# Altium project Main-2026.PrjPcb
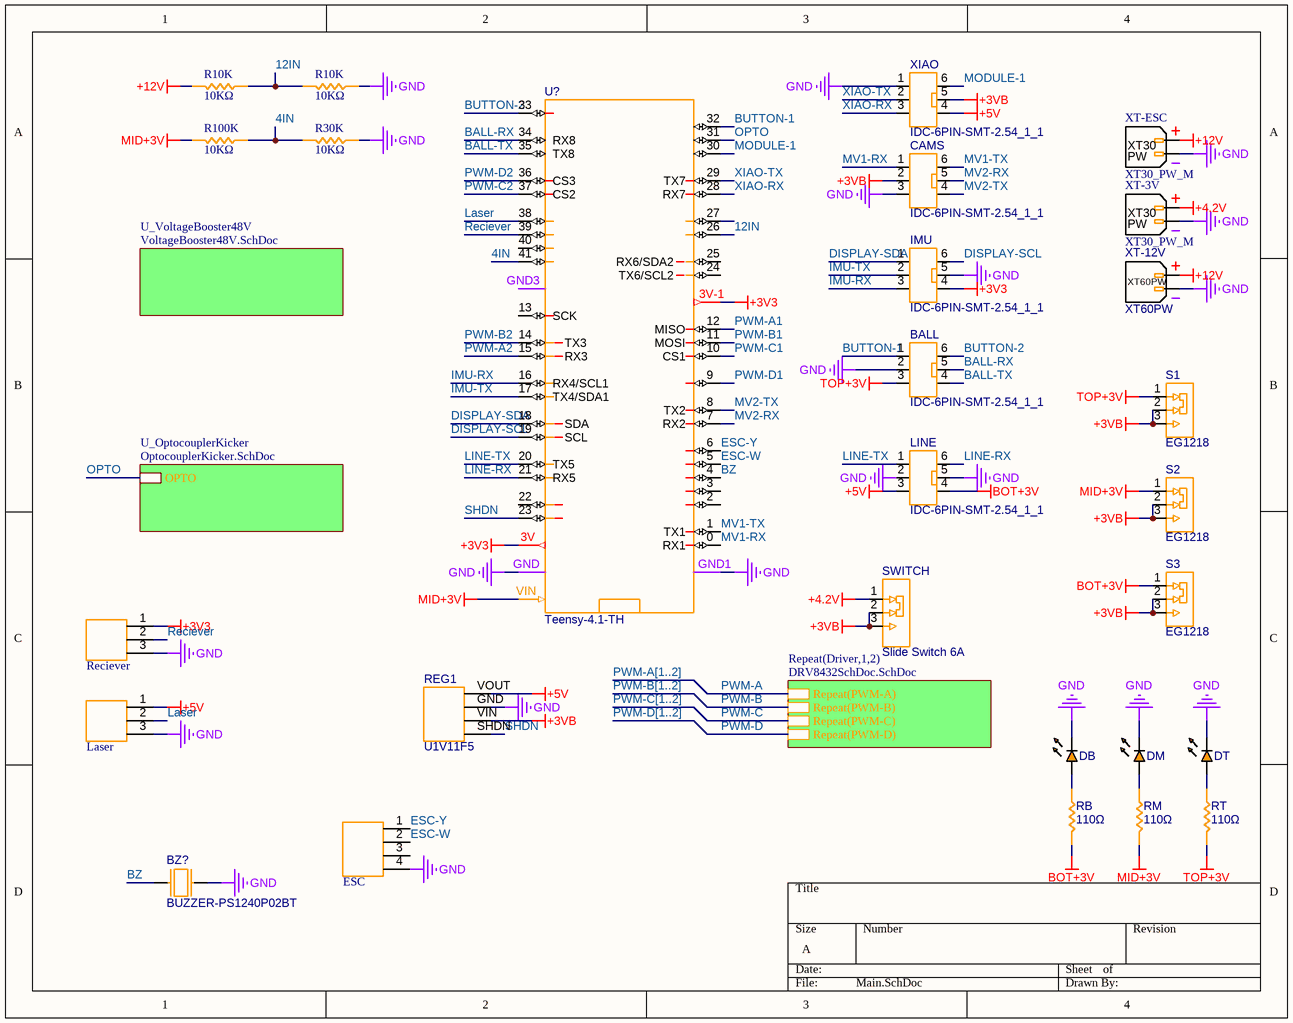
[diagram p0: Main.SchDoc]
4 sheets, 86 parts. Net scope: hierarchical (ports join the sheet entries above them; power ports are global).
Board file: MainBoard-16.PcbDoc
Sheets:
  Main.SchDoc
    Driver1 = DRV8432SchDoc.SchDoc
    Driver2 = DRV8432SchDoc.SchDoc
    U_VoltageBooster48V = VoltageBooster48V.SchDoc
    U_OptocouplerKicker = OptocouplerKicker.SchDoc

## Sheet Main.SchDoc
size A; SheetNumber: 1; SheetTotal: 4

### Parts
(Parts that share a designator on the sheet are numbered #1, #2 ... from top to bottom, then left to right.)
BALL  IDC-6PIN-SMT-2.54_1_1  [IDC-6PIN-SMT-2.54]
BZ?  BUZZER-PS1240P02BT  [BUZZER-PS1240P02BT]
CAMS  IDC-6PIN-SMT-2.54_1_1  [IDC-6PIN-SMT-2.54]
DB  LED_0603  [LED_0603]  (value not drawn)
DM  LED_0603  [LED_0603]  (value not drawn)
DT  LED_0603  [LED_0603]  (value not drawn)
ESC  4PIN  [4PIN]  (value not drawn)
IMU  IDC-6PIN-SMT-2.54_1_1  [IDC-6PIN-SMT-2.54]
Laser  3PIN  [3PIN]  (value not drawn)
LINE  IDC-6PIN-SMT-2.54_1_1  [IDC-6PIN-SMT-2.54]
R10K#1  10KΩ  [RES_0603]
R10K#2  10KΩ  [RES_0603]
R30K  10KΩ  [RES_0603]
R100K  10KΩ  [RES_0603]
RB  110Ω  [RES_0603]
Reciever  3PIN  [3PIN]  (value not drawn)
REG1  U1V11F5  [U1V11F5]
RM  110Ω  [RES_0603]
RT  110Ω  [RES_0603]
S1  EG1218  [EG1218]
S2  EG1218  [EG1218]
S3  EG1218  [EG1218]
SWITCH  Slide Switch 6A  [Slide Switch 6A]
U?  Teensy-4.1-TH  [Teensy-4.1-TH]
XIAO  IDC-6PIN-SMT-2.54_1_1  [IDC-6PIN-SMT-2.54]
XT-3V  XT30_PW_M  [XT30_PW_M]
XT-12V  XT60PW  [XT60PW]
XT-ESC  XT30_PW_M  [XT30_PW_M]

### Sub-sheets
Repeat(Driver,1,2) = DRV8432SchDoc.SchDoc: Repeat(PWM-A), Repeat(PWM-B), Repeat(PWM-C), Repeat(PWM-D)
U_OptocouplerKicker = OptocouplerKicker.SchDoc: OPTO
U_VoltageBooster48V = VoltageBooster48V.SchDoc: no entries

### Nets
+3V3: IMU.4 Reciever.1 U?.3V U?.3V-1
+3VB: CAMS.2 REG1.VIN S1.2(COM) S1.3(NO) S2.2(COM) S2.3(NO) S3.2(COM) S3.3(NO) SWITCH.2(COM) SWITCH.3(NO) XIAO.5
+4.2V: SWITCH.1(NC) XT-3V.P
+5V: Laser.1 LINE.3 REG1.VOUT XIAO.4
+12V: R10K#1.1 XT-12V.P XT-ESC.P
BOT+3V: LINE.4 RB.1 S3.1(NC)
GND: BALL.2 BZ?.2 CAMS.3 DB.C DM.C DT.C ESC.4 IMU.5 Laser.3 LINE.2 LINE.5 R10K#2.2 R30K.2 Reciever.3 REG1.GND U?.GND U?.GND1 XIAO.1 XT-3V.N XT-12V.N XT-ESC.N
MID+3V: R100K.1 RM.1 S2.1(NC) U?.VIN
TOP+3V: BALL.3 RT.1 S1.1(NC)
4IN: R30K.1 R100K.2 U?.41
12IN: R10K#1.2 R10K#2.1 U?.26
BALL-RX: BALL.5 U?.34(RX8)
BALL-TX: BALL.4 U?.35(TX8)
BUTTON-1: BALL.1 U?.32
BUTTON-2: BALL.6 U?.33
BZ: BZ?.1 U?.4
DISPLAY-SCL: IMU.6 U?.19(SCL)
DISPLAY-SDA: IMU.1 U?.18(SDA)
ESC-W: ESC.2 U?.5
ESC-Y: ESC.1 U?.6
IMU-RX: IMU.3 U?.16(RX4/SCL1)
IMU-TX: IMU.2 U?.17(TX4/SDA1)
Laser: Laser.2 U?.38
LINE-RX: LINE.6 U?.21(RX5)
LINE-TX: LINE.1 U?.20(TX5)
MODULE-1: U?.30 XIAO.6
MV1-RX: CAMS.1 U?.0(RX1)
MV1-TX: CAMS.6 U?.1(TX1)
MV2-RX: CAMS.5 U?.7(RX2)
MV2-TX: CAMS.4 U?.8(TX2)
OPTO: U?.31 ; sheet U_OptocouplerKicker/OPTO
PWM-A: sheet Repeat(Driver,1,2)/Repeat(PWM-A)
PWM-A1: U?.12(MISO)
PWM-A2: U?.15(RX3)
PWM-B: sheet Repeat(Driver,1,2)/Repeat(PWM-B)
PWM-B1: U?.11(MOSI)
PWM-B2: U?.14(TX3)
PWM-C: sheet Repeat(Driver,1,2)/Repeat(PWM-C)
PWM-C1: U?.10(CS1)
PWM-C2: U?.37(CS2)
PWM-D: sheet Repeat(Driver,1,2)/Repeat(PWM-D)
PWM-D1: U?.9
PWM-D2: U?.36(CS3)
Reciever: Reciever.2 U?.39
SHDN: REG1.SHDN U?.23
XIAO-RX: U?.28(RX7) XIAO.3
XIAO-TX: U?.29(TX7) XIAO.2
NetDB_A: DB.A RB.2
NetDM_A: DM.A RM.2
NetDT_A: DT.A RT.2

Not connected (* = marked no-connect by the designer): ESC 3(03); U? 2 3 13(SCK) 22 24(TX6/SCL2) 25(RX6/SDA2) 27 40 GND3

### Buses and harness runs
bus PWM-A[1..2]
bus PWM-B[1..2]
bus PWM-C[1..2]
bus PWM-D[1..2]

### Notes on the sheet
- (in symbol XT30_PW_M) XT30; PW

### Library data of the parts
ESC = 4PIN: 2.54 Header
Laser Reciever = 3PIN: 2.54 Header
R10K#1 R10K#2 R30K R100K RB RM RT = RES_0603: Resistor SMD 0603 generic

## Sheet DRV8432SchDoc.SchDoc
size A; SheetNumber: 2; SheetTotal: 4
Used 2 times, as channels Driver1, Driver2. Parts and nets are listed once, with the designators drawn on the sheet.
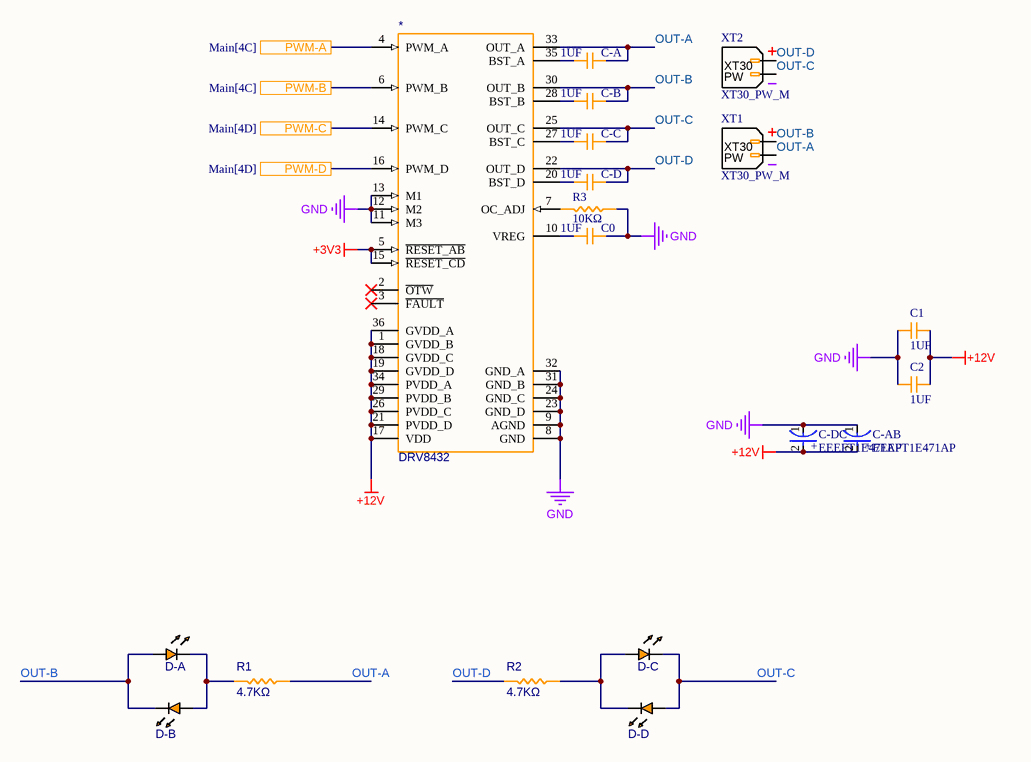
[diagram p1: DRV8432SchDoc.SchDoc]

### Parts
*  DRV8432  [DRV8432]
C0  1UF  [CAP_0603]
C1  1UF  [CAP_0603]
C2  1UF  [CAP_0603]
C-A  1UF  [CAP_0603]
C-AB  EEEFT1E471AP  [FP-FTF-MFG]
C-B  1UF  [CAP_0603]
C-C  1UF  [CAP_0603]
C-D  1UF  [CAP_0603]
C-DC  EEEFT1E471AP  [FP-FTF-MFG]
D-A  LED_0603  [LED_0603]  (value not drawn)
D-B  LED_0603  [LED_0603]  (value not drawn)
D-C  LED_0603  [LED_0603]  (value not drawn)
D-D  LED_0603  [LED_0603]  (value not drawn)
R1  4.7KΩ  [RES_0603]
R2  4.7KΩ  [RES_0603]
R3  10KΩ  [RES_0603]
XT1  XT30_PW_M  [XT30_PW_M]
XT2  XT30_PW_M  [XT30_PW_M]

### Ports
PWM-A (see Main[4C]), PWM-B (see Main[4C]), PWM-C (see Main[4D]), PWM-D (see Main[4D])

### Nets
+3V3: *.5(~{RESET_AB}) *.15(~{RESET_CD})
+12V: *.1(GVDD_B) *.17(VDD) *.18(GVDD_C) *.19(GVDD_D) *.21(PVDD_D) *.26(PVDD_C) *.29(PVDD_B) *.34(PVDD_A) *.36(GVDD_A) C1.2 C2.2 C-AB.2(A) C-DC.2(A)
GND: *.8(GND) *.9(AGND) *.11(M3) *.12(M2) *.13(M1) *.23(GND_D) *.24(GND_C) *.31(GND_B) *.32(GND_A) C0.2 C1.1 C2.1 C-AB.1(C) C-DC.1(C) R3.2
OUT-A: *.33(OUT_A) C-A.2 R1.2 XT1.N
OUT-B: *.30(OUT_B) C-B.2 D-A.A D-B.C XT1.P
OUT-C: *.25(OUT_C) C-C.2 D-C.C D-D.A XT2.N
OUT-D: *.22(OUT_D) C-D.2 R2.1 XT2.P
PWM-A: *.4(PWM_A) ; port PWM-A
PWM-B: *.6(PWM_B) ; port PWM-B
PWM-C: *.14(PWM_C) ; port PWM-C
PWM-D: *.16(PWM_D) ; port PWM-D
Net*_7: *.7(OC_ADJ) R3.1
Net*_10: *.10(VREG) C0.1
Net*_20: *.20(BST_D) C-D.1
Net*_27: *.27(BST_C) C-C.1
Net*_28: *.28(BST_B) C-B.1
Net*_35: *.35(BST_A) C-A.1
NetD-A_C: D-A.C D-B.A R1.1
NetD-C_A: D-C.A D-D.C R2.2

Not connected (* = marked no-connect by the designer): * 2(~{OTW})* 3(~{FAULT})*

### Channels
Driver1: designators end in _Driver1; ports PWM-A=PWM-A1 PWM-B=PWM-B1 PWM-C=PWM-C1 PWM-D=PWM-D1
Driver2: designators end in _Driver2; ports PWM-A=PWM-A2 PWM-B=PWM-B2 PWM-C=PWM-C2 PWM-D=PWM-D2

### Notes on the sheet
- (in symbol CMP-05427-000040-1) +
- (in symbol XT30_PW_M) XT30; PW

### Library data of the parts
C0-C2 C-A C-B C-C C-D = CAP_0603: Capacitor SMD 0603 generic
C-AB C-DC = CMP-05427-000040-1: CAP ALUM 470UF 20% 25V SMD; ESR (Equivalent Series Resistance): 80mR; Dielectric Material: Aluminium; Lead Diameter: 0.9mm; Ripple Current: 850mA; Leakage Current: 117.5uA; Life (Hours): 2000Hour; Lead Free: Lead Free; Height - Seated (Max): 0.413inch; Contact Plating: Tin; Voltage: 25V; Package Quantity: 500; REACH SVHC: No SVHC; Diameter: 8mm; Features: General Purpose; Voltage Rating: 25V; Radiation Hardening: No; Number of Pins: 2; Length: 10.2mm; Max Operating Temperature: 105°C; Tolerance: 20%; Lead Pitch: 3.1mm; Voltage Rating (DC): 25V; Packaging: Tape and Reel; RoHS Compliant: Yes; Series: FT; Height: 10.2mm; Capacitance: 470uF; Construction: Cylindrical; Case/Package: Radial; Mount: Surface Mount; Termination: SMD/SMT; Min Operating Temperature: -55°C; Ripple Current (AC): 850mA
R1-R3 = RES_0603: Resistor SMD 0603 generic

## Sheet VoltageBooster48V.SchDoc
size A; SheetNumber: 4; SheetTotal: 4
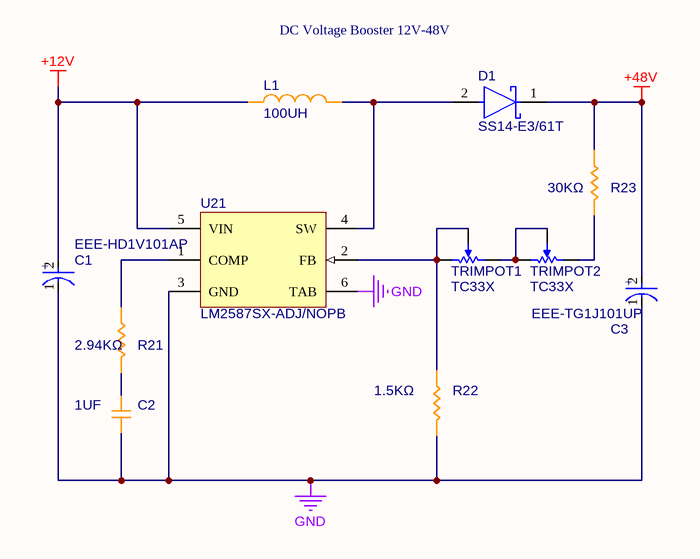
[diagram p2: VoltageBooster48V.SchDoc]

### Parts
C1  EEE-HD1V101AP  [FP-HDG-MFG]
C2  1UF  [CAP_0603]
C3  EEE-TG1J101UP  [FP-TGG-MFG]
D1  SS14-E3/61T  [FP-95400-MFG]
L1  100UH  [IND_Boost]
R21  2.94KΩ  [RES_0603]
R22  1.5KΩ  [RES_0603]
R23  30KΩ  [RES_0603]
TRIMPOT1  TC33X  [BOUR-TC33X-2_V]
TRIMPOT2  TC33X  [BOUR-TC33X-2_V]
U21  LM2587SX-ADJ/NOPB  [KTT0005B_N]

### Nets
+12V: C1.2(A) L1.1 U21.5(VIN)
+48V: C3.2(A) D1.1(C) R23.2
GND: C1.1(C) C2.1 C3.1(C) R22.1 U21.3(GND) U21.6(TAB)
NetC2_2: C2.2 R21.1
NetD1_2: D1.2(A) L1.2 U21.4(SW)
NetR21_2: R21.2 U21.1(COMP)
NetR22_2: R22.2 TRIMPOT1.1 TRIMPOT1.2 U21.2(FB)
NetR23_1: R23.1 TRIMPOT2.3
NetTRIMPOT1_3: TRIMPOT1.3 TRIMPOT2.1 TRIMPOT2.2

### Notes on the sheet
- DC Voltage Booster 12V-48V
- (in symbol CMP-00287-42869300-1) +
- (in symbol CMP-05427-002169-1) +

### Library data of the parts
C1 = CMP-00287-42869300-1: EEE-HD1V101AP Aluminum Electrolytic Capacitor, 100 uF, 35 V, ± 20%, 5000 hours @ 105°C, Radial Can - SMD; Voltage: 35V; ESR (Equivalent Series Resistance): 800mΩ; Ripple Current (AC): 101mA; Leakage Current: 35µA; Dissipation Factor: 14%; Dielectric Material: Aluminium; Capacitance: 100µF; Lifecycle Status: Production; Life (Hours): 5000hours; Tolerance: 20%; Height - Seated (Max): 10.2108mm; Number of Pins: 2; Length: 10.5mm; REACH SVHC: No SVHC; Min Operating Temperature: -40°C; Mount: PCB, Surface Mount; Lead Pitch: 4.6mm; Voltage Rating (DC): 35V; Lead Free: Lead Free; RoHS: Compliant; Ripple Current: 101mA; Height: 10.2mm; Termination: SMD/SMT; NexarPartId: 42869300; Packaging: Cut Tape; Radiation Hardening: No; Case/Package: Radial; Voltage Rating: 35V; Schedule B: 8532220020, 8532220020; Diameter: 10mm; Max Operating Temperature: 105°C; Impedance: 800mΩ
C2 = CAP_0603: Capacitor SMD 0603 generic
C3 = CMP-05427-002169-1: CAP ALUM 100UF 20% 63V SMD; ESR (Equivalent Series Resistance): 800mR; Ripple Current: 150mA; Dissipation Factor: 0.12%; Life (Hours): 2000Hour; Package Quantity: 500; Series: TG; Height: 10.2mm; Construction: Cylindrical; Lead Free: Lead Free; Ratings: AEC-Q200; Mount: Surface Mount; Termination: SMD/SMT; Case/Package: Radial; Length: 10.2mm; Diameter: 10mm; Height - Seated (Max): 0.402inch; Reach SVHC Compliant: Yes; Capacitance: 100uF; Packaging: Tape and Reel; Max Operating Temperature: 125°C; Voltage: 63V; RoHS Compliant: Yes; Tolerance: 20%; Min Operating Temperature: -40°C; Voltage Rating: 63V; Width: 900um; Ripple Current (AC): 150mA; Voltage Rating (DC): 63V; Contact Plating: Tin; Radiation Hardening: No
D1 = CMP-02539-000035-1: DIODE SCHOTTKY 40V 1A DO214AC; Manufacturer: Vishay; Peak Reverse Current: 0.2mA; Standoff Height: 0mm; Max Junction Temp: +150°C; Max Surge Forward Current: 40A; RoHS: TRUE; Digikey Description: DIODE SCHOTTKY 40V 1A DO214AC; Category: Diode; Device Class L3: Schottky Diodes; Temperature Range High: +150°C; Automotive: No; Temperature: -65°C to +150°C; Device Class L2: Diodes; Forward Current: 1A; Temperature Range Low: -65°C; Footprint Url: http://www.vishay.com/docs/95400/sma.pdf; Octopart: https://octopart.com/ss14-e3%2F61t-vishay-39552847; Package: 95400; Max Repetitive Reverse Voltage: 40V; ComponentLink2Description: Datasheet; ComponentLink2URL: http://www.vishay.com/docs/88746/ss12.pdf; Lead Free: Yes; Height: 2.29mm; Mouser Description: SS14 Series 40 V 1 A Surface Mount Schottky Barrier Rectifier - DO-214AC (SMA); Manufacturer Part Number: SS14-E3/61T; Device Class L1: Discrete Semiconductors
L1 = Boost Inductor: Voltage Boost Inductor
R21-R23 = RES_0603: Resistor SMD 0603 generic
TRIMPOT1 TRIMPOT2 = CMP-2100-03695-1: Trimming Potentiometer, 10000 Ohm, -40 to 100 degC, 3-Pin SMD, RoHS, Tape and Reel; Manufacturer: Bourns; Tolerance: 25%; Max Power Dissipation: 100mW; Number of Turns: 1; Resistance: 10KOhm; Temperature Coefficient: 250ppm/degreesC; Voltage Rating (DC): 50V; Datasheet URL: http://www.bourns.com/docs/Product-Datasheets/TC33.pdf; Composition: Potentiometer; Package Description: 3-Pin Surface Mount Device, Body 3.8 x 3.6 mm; Weight: 29.4mg; Power Rating: 100mW; Termination: FootPrint; Manufacturer URL: http://www.bourns.com/; Width: 0.118inch; Height: 0.047inch; Military Standard: Not; Radiation Hardening: No; Colour: Silver; Case/Package: SMD/SMT; Depth: 3.8mm; Min Operating Temperature: -40degC; Lead Free: LeadFree; Datasheet Version: 42583.0; REACH SVHC: NoSVHC; Length: 3mm; RoHSCompliant: true; Contact Plating: Silver; Taper: Linear; Packaging: TapeandReel; Mount: SurfaceMount; Max Operating Temperature: 100degC; Package Reference: TC33X-2; Package Quantity: 2500
U21 = CMP-0069-00069-3: 5A Flyback Regulator, 5-pin TO-263, Pb-Free; Manufacturer: Texas Instruments; PowerWise: N; CompType: Switcher; PackageTopMarking: NSUZXYTTE#*LM2587S*-ADJ P+; PackageDescription: TO-263, Molded, .400 x .390 x .180in, 5 Lead, .067in Pitch, Surface Mount; ComponentLink1URL: http://www.ti.com/general/docs/lit/getliterature.tsp?genericPartNumber=LM2587&fileType=pdf; Code_JEDEC: MO-169-AB; PinCount: 5; PackageReference: KTT0005B; ComponentLink1Description: Datasheet URL; RoHS: Y

## Sheet OptocouplerKicker.SchDoc
size A; SheetNumber: 3; SheetTotal: 4
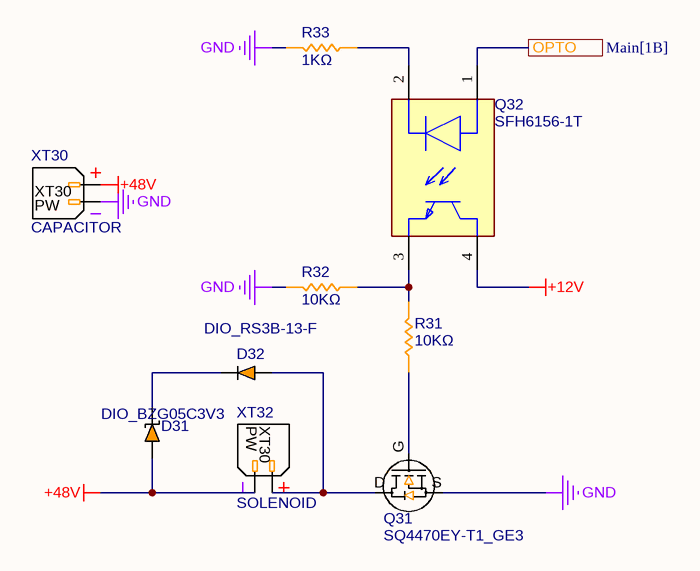
[diagram p3: OptocouplerKicker.SchDoc]

### Parts
D31  DIO_BZG05C3V3  [DIO_BZG05C3V3]
D32  DIO_RS3B-13-F  [DIO_RS3B-13-F]
Q31  SQ4470EY-T1_GE3  [SQ4470EY-T1_GE3]
Q32  SFH6156-1T  [FP-83911-MFG]
R31  10KΩ  [RES_0603]
R32  10KΩ  [RES_0603]
R33  1KΩ  [RES_0603]
XT30  CAPACITOR  [XT30_PW_M]
XT32  SOLENOID  [XT30_PW_M]

### Ports
OPTO (see Main[1B])

### Nets
+12V: Q32.4(C)
+48V: D31.A XT30.P XT32.N
GND: Q31.S R32.1 R33.1 XT30.N
OPTO: Q32.1(A) ; port OPTO
NetD31_C: D31.C D32.C
NetD32_A: D32.A Q31.D XT32.P
NetQ31_G: Q31.G R31.2
NetQ32_2: Q32.2(C) R33.2
NetQ32_3: Q32.3(E) R31.1 R32.2

### Notes on the sheet
- (in symbol XT30_PW_M) PW; XT30

### Library data of the parts
Q32 = CMP-00030-03895371-1: SFH6156-1T Optocoupler Dc-in 1-CH Transistor Dc-out 4-PIN PDIP SMD T/r; Fall Time: 11s; Number of Elements: 1; Output Voltage: 70V; Forward Current: 60mA; Forward Voltage: 1.25V; Turn-On Delay Time: 3µs; Power Dissipation: 150mW; Isolation Voltage: 5.3kV; Collector Emitter Saturation Voltage: 400mV; Output Current per Channel: 50mA; Reverse Breakdown Voltage: 6V; Max Collector Current: 100mA; Current Transfer Ratio: 80%; Rise Time: 2s; Turn-Off Delay Time: 2.3µs; Mount: PCB, Surface Mount; NexarPartId: 3895371; Ambient Temperature Range High: 100°C; Number of Channels: 1; Number of Pins: 4; RoHS: Compliant; Max Output Voltage: 70V; Case/Package: SMD/SMT; Radiation Hardening: No; Max Input Current: 60mA; Height: 4.059mm; Max Power Dissipation: 150mW; Packaging: Digi-Reel®; Max Operating Temperature: 100°C; Schedule B: 8541408000, 8541408000; Reverse Voltage: 6V; Lead Free: Lead Free; Min Operating Temperature: -55°C; Collector Emitter Voltage (VCEO): 70V; Input Current: 60mA
R31-R33 = RES_0603: Resistor SMD 0603 generic
XT30 XT32 = XT30_PW_M

## Nets that join several sheets
+3V3: Main (IMU.4 Reciever.1 U?.3V U?.3V-1), Driver1 (*_Driver1.5 *_Driver1.15), Driver2 (*_Driver2.5 *_Driver2.15)
+12V: Main (R10K#1.1 XT-12V.P XT-ESC.P), Driver1 (13 pins), Driver2 (13 pins), VoltageBooster48V (C1.2 L1.1 U21.5), OptocouplerKicker (Q32.4)
+48V: VoltageBooster48V (C3.2 D1.1 R23.2), OptocouplerKicker (D31.A XT30.P XT32.N)
GND: Main (21 pins), Driver1 (15 pins), Driver2 (15 pins), VoltageBooster48V (6 pins), OptocouplerKicker (Q31.S R32.1 R33.1 XT30.N)
OPTO: Main (U?.31), OptocouplerKicker (Q32.1)
PWM-A1: Main (U?.12), Driver1 (*_Driver1.4)
PWM-A2: Main (U?.15), Driver2 (*_Driver2.4)
PWM-B1: Main (U?.11), Driver1 (*_Driver1.6)
PWM-B2: Main (U?.14), Driver2 (*_Driver2.6)
PWM-C1: Main (U?.10), Driver1 (*_Driver1.14)
PWM-C2: Main (U?.37), Driver2 (*_Driver2.14)
PWM-D1: Main (U?.9), Driver1 (*_Driver1.16)
PWM-D2: Main (U?.36), Driver2 (*_Driver2.16)